# Altium schematic sheet Measurement.SchDoc
size A4; CompanyName: Technische Hochschule Nürnberg Georg Simon Ohm; Organization: UltraZohm; Address1: Kesslerplatz 12; Address2: 90489 Nürnberg; Address3: GERMANY; DocumentNumber: 3; SheetNumber: 3; SheetTotal: 4; Website: www.ultrazohm.com
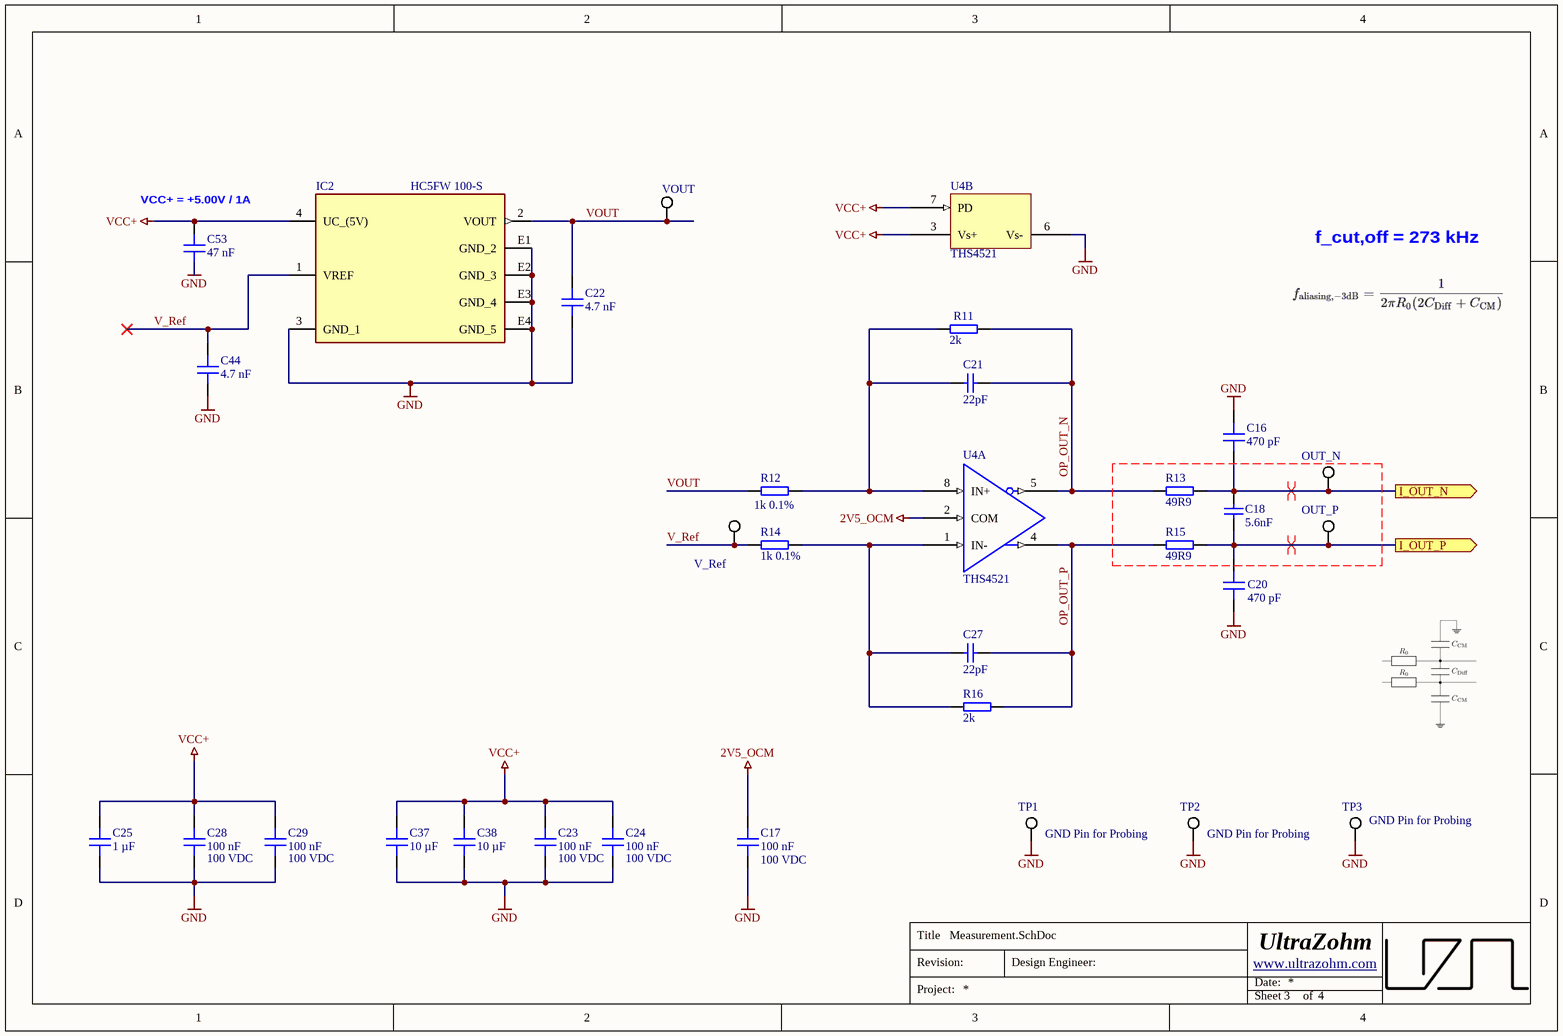
[diagram p0: Measurement.SchDoc]

## Parts
C16  470 pF  [C_0603]
C17  100 nF  Voltage Rating: 100 VDC  [C_0603]
C18  5.6nF  [C_0603_TE]
C20  470 pF  [C_0603]
C21  22pF  [C_0603_TE]
C22  4.7 nF  [C_0603]
C23  100 nF  Voltage Rating: 100 VDC  [C_0603]
C24  100 nF  Voltage Rating: 100 VDC  [C_0603]
C25  1 µF  [C_0603]
C27  22pF  [C_0603_TE]
C28  100 nF  Voltage Rating: 100 VDC  [C_0603]
C29  100 nF  Voltage Rating: 100 VDC  [C_0603]
C37  10 µF  [C0805]
C38  10 µF  [C0805]
C44  4.7 nF  [C_0603]
C53  47 nF  [C_0603]
IC2  HC5FW 100-S  [LEM_HC5FW]
OUT_N  5015  [KSTN-5019_V]  (value not drawn)
OUT_P  5015  [KSTN-5019_V]  (value not drawn)
R11  2k  [RES 0603_1608]
R12  1k 0.1%  [RES 0603_1608]
R13  49R9  [RES 0603_1608]
R14  1k 0.1%  [RES 0603_1608]
R15  49R9  [RES 0603_1608]
R16  2k  [RES 0603_1608]
TP1  5015  [KSTN-5019_V]  (value not drawn)
TP2  5015  [KSTN-5019_V]  (value not drawn)
TP3  5015  [KSTN-5019_V]  (value not drawn)
U4  THS4521  [SOIC127P600X175-8N]  (parts A,B of 2)
V_Ref  5015  [KSTN-5019_V]  (value not drawn)
VOUT  5019  [KSTN-5019_V]  (value not drawn)

## Ports
I_OUT_N (out), I_OUT_P (out)

## Nets
2V5_OCM: C17.1 U4.2(COM)
GND: C16.1 C17.2 C20.2 C22.1 C23.1 C24.1 C25.1 C28.1 C29.1 C37.1 C38.1 C44.1 C53.1 IC2.3(GND_1) IC2.E1(GND_2) IC2.E2(GND_3) IC2.E3(GND_4) IC2.E4(GND_5) TP1.1 TP2.1 TP3.1 U4.6(Vs-)
VCC+: C23.2 C24.2 C25.2 C28.2 C29.2 C37.2 C38.2 C53.2 IC2.4(UC_(5V)) U4.3(Vs+) U4.7(PD)
I_OUT_N: C16.2 C18.1 OUT_N.1 R13.2 ; port I_OUT_N
I_OUT_P: C18.2 C20.1 OUT_P.1 R15.2 ; port I_OUT_P
OP_OUT_N: C21.1 R11.2 R13.1 U4.5(OUT-)
OP_OUT_P: C27.1 R15.1 R16.2 U4.4(OUT+)
V_Ref: C44.2 IC2.1(VREF) R14.1 V_Ref.1
VOUT: C22.2 IC2.2(VOUT) R12.1 VOUT.1
NetC21_2: C21.2 R11.1 R12.2 U4.8(IN+)
NetC27_2: C27.2 R14.2 R16.1 U4.1(IN-)

## Layout directives
differential pair: I_OUT_N, I_OUT_P

## Notes on the sheet
- (near C53) VCC+ = +5.00V / 1A
- f_cut,off = 273 kHz
- (near TP1) GND Pin for Probing
- (near TP2) GND Pin for Probing
- (near TP3) GND Pin for Probing
- Title
- Revision:
- Design Engineer:
- Date:
- Project:
- Sheet
- of

## Library data of the parts
C16 C20 = C0603C471K5RACAUTO: 50V 470pF X7R ±10% 0603 Multilayer Ceramic Capacitors MLCC - SMD/SMT ROHS; Manufacturer: KEMET; Voltage Rating: 50 VDC; Created from: KIlhan; Manufacturer Part Number: C0603C471K5RACAUTO; ComponentLink1Description: Datasheet; ComponentLink1URL: https://lcsc.com/datasheet/lcsc_datasheet_2410010302_KEMET-C0603C471K5RACAUTO_C129628.pdf; Series: SMD Comm X7R; Supplier 1: JLCPCB; Supplier Part Number 1: C129628; Tolerance: 10 %; PartID: 500; Created On: 07/07/2025 10:21:07; Component Type: Capacitor 0603; Device Package: 0603; Last Updated: 07/07/2025 10:21:07; Mounting Type: SMD; Operating Temperature: -55 - 125°C; Type: Capacitor; Value: 470 pF; Live Cycle Status: 1; Stock number: not stored; LCSC Part Number: C129628
C17 C23 C24 C28 C29 = C1608X7S2A104KT000N: 100V 100nF X7S ±10% 0603 Multilayer Ceramic Capacitors MLCC - SMD/SMT ROHS; Manufacturer: TDK; Created from: AGeiger; Manufacturer Part Number: C1608X7S2A104KT000N; PartID: 148; Created On: 20.12.2020 13:54:13; ComponentLink1Description: Datasheet; ComponentLink1URL: https://datasheet.lcsc.com/lcsc/2304140030_TDK-C1608X7S2A104KT000N_C343025.pdf; Component Type: Capacitor 0603; Device Package: 0603; Last Updated: 14.12.2022 12:14:21; Mounting Type: SMD; Operating Temperature: -55 to 125°C; Series: X7R; Supplier 1: LCSC; Supplier Part Number 1: C343025; Type: Capacitor; Tolerance: 10 %; Value: 100 nF; Live Cycle Status: 1; LCSC Part Number: C343025; Stock number: not stored
C18 = 0603B562K500NT: 50V 5.6nF X7R ±10% 0603 Multilayer Ceramic Capacitors MLCC - SMD/SMT ROHS; Manufacturer: FH (Guangdong Fenghua Advanced Tech); Created from: Kilhan; Manufacturer Part Number: 0603B562K500NT; ComponentLink1Description: Datasheet; ComponentLink1URL: https://jlcpcb.com/api/file/downloadByFileSystemAccessId/8588903217349971968; Series: X7R; Supplier 1: LCSC; Supplier Part Number 1: C1628; Tolerance: 10%; Voltage Rating: 50V; PartID: 171; Created On: 18/06/2025 16:23:16; Component Type: Capacitor 0603; Device Package: 0603; Last Updated: 18/06/2025 16:23:16; Mounting Type: SMD; Operating Temperature: –55 to 125°C; Type: Capacitor; Value: 5.6nF; Live Cycle Status: 1; Stock number: not stored; LCSC Part Number: C1628
C21 C27 = CL10C220JB8NNNC: 50V 22pF C0G ±5% 0603 Multilayer Ceramic Capacitors MLCC - SMD/SMT ROHS; Manufacturer: Samsung Electro-Mechanics; Created from: Kilhan; Manufacturer Part Number: CL10C220JB8NNNC; ComponentLink1Description: Datasheet; ComponentLink1URL: https://jlcpcb.com/api/file/downloadByFileSystemAccessId/8579707043277824000; Series: C0G; Supplier 1: LCSC; Supplier Part Number 1: C1653; Tolerance: 5%; Voltage Rating: 50V; PartID: 172; Created On: 22/06/2025 13:02:55; Component Type: Capacitor 0603; Device Package: 0603; Last Updated: 22/06/2025 13:02:55; Mounting Type: SMD; Operating Temperature: –55 to 125°C; Type: Capacitor; Value: 22pF; Live Cycle Status: 1; Stock number: not stored; LCSC Part Number: C1653
C22 C44 = C0603C472K4RECAUTO: Capacitor 0603, 16 VDC, 4.7 nF, X7R; Manufacturer: KEMET; Tolerance: 10 %; Voltage Rating: 16 VDC; Created from: MGremer; Manufacturer Part Number: C0603C472K4RECAUTO; PartID: 35; Created On: 20/12/2020 13:54:13; ComponentLink1Description: Datasheet; ComponentLink1URL: https://www.mouser.de/datasheet/2/212/1/KEM_C1090_X7R_ESD-1103328.pdf; Component Type: Capacitor 0603; Device Package: 0603; Last Updated: 05/08/2026 12:55:18; Mounting Type: SMD; Operating Temperature: -55 - 125°C; Series: ESD SMD Auto X7R; Supplier 1: Mouser; Supplier Part Number 1: 80-C0603C472K4RECAUT; Type: Capacitor; Value: 4.7 nF; Live Cycle Status: 1; LCSC Part Number: C2176713; Stock number: Labor SMD Container
C25 = CL10A105KB8NNNC: 50V 1uF X5R ±10% 0603  Multilayer Ceramic Capacitors MLCC - SMD/SMT ROHS; Manufacturer: Samsung Electro-Mechanics; Voltage Rating: 50 VDC; Created from: MGremer; Manufacturer Part Number: CL10A105KB8NNNC; PartID: 5; Created On: 20/12/2020 13:54:13; ComponentLink1Description: Datasheet; ComponentLink1URL: https://datasheet.lcsc.com/lcsc/1810261812_Samsung-Electro-Mechanics-CL10A105KB8NNNC_C15849.pdf; Component Type: Capacitor 0603; Device Package: 0603; Last Updated: 28/11/2022 17:23:01; Mounting Type: SMD; Operating Temperature: -55 - 85°C; Series: M; Supplier 1: LCSC; Supplier Part Number 1: C15849; Type: Capacitor; Tolerance: 10 %; Value: 1 µF; Live Cycle Status: 1; Stock number: Labor SMD Container; LCSC Part Number: C15849
C37 C38 = GRM21BR6YA106KE43L: Capacitor 0805, 35 VDC, 10 µF, X5R; Manufacturer: muRata; Tolerance: 10 %; Voltage Rating: 35 VDC; Created from: MGremer; Manufacturer Part Number: GRM21BR6YA106KE43L; PartID: 28; Created On: 20.12.2020 13:54:13; ComponentLink1Description: Datasheet; ComponentLink1URL: https://www.mouser.de/datasheet/2/281/murata_03052018_GRM_Series_1-1310166.pdf; Component Type: Capacitor 0805; Device Package: 0805; Last Updated: 20.12.2020 17:44:37; Mounting Type: SMD; Operating Temperature: -55 - 85°C; Series: GRM; Supplier 1: Mouser; Supplier Part Number 1: 81-GRM21BR6YA106KE3L; Type: Capacitor; Value: 10 µF; Live Cycle Status: 1; Stock number: Labor SMD Container; LCSC Part Number: C162422
C53 = CL10B473KB8NNNC: Capacitor 0603, 50 VDC, 47 nF, X7R; Manufacturer: Samsung Electro-Mechanics; Tolerance: 10 %; Voltage Rating: 50 VDC; Created from: DHufnagel; Manufacturer Part Number: CL10B473KB8NNNC; PartID: 97; Created On: 20/07/2022 09:55:05; ComponentLink1Description: Datasheet; ComponentLink1URL: https://www.mouser.de/datasheet/2/585/MLCC-1837944.pdf; Component Type: Capacitor 0603; Device Package: 0603; Last Updated: 20/07/2022 09:55:05; Mounting Type: SMD; Operating Temperature: -55 - 125°C; Series: X7R; Supplier 1: Mouser; Supplier Part Number 1: 187-CL10B473KB8NNNC; Supplier 2: LCSC; Supplier Part Number 2: C1622; Type: Capacitor; Value: 47 nF; Live Cycle Status: 1; LCSC Part Number: C1622; Stock number: not stored
IC2 = HC5FW 100-S: -100 A - 100 A, 40 kHz; Manufacturer: LEM; Value: 100A; Created from: TGaupp; Datasheet Link: https://www.lem.com/sites/default/files/products_datasheets/cksr_series.pdf; Height: 16mm; Manufacturer Part Number: HC5FW 100-S; Supplier Part Number 1: 61-HC5FW100-S; Mounting Technology: THT; Supplier 1: Mouser; PartID: 7; Created On: 01/07/2026 10:26:16; ComponentLink1Description: Datasheet; ComponentLink1URL: https://www.lem.com/sites/default/files/products_datasheets/hc5fw_100-s.pdf; Component Type: Hall-Current Sensor; Device Package: THT; Last Updated: 01/07/2026 10:26:16; Mounting Type: THT; Operating Temperature: -40 - 125°C; Series: HC5 Series; Type: Current Sensor; Live Cycle Status: 1; Stock number: not stocked
OUT_N OUT_P TP1-TP3 V_Ref = 5015: Circuit Board Hardware - PCB SM TEST POINT ON T&R - MINIATURE; Manufacturer: Keystone Electronics; Value: SMD Testpoint; Created from: AGeiger; Supplier Part Number 1: 534-5015; LCSC Part Number: C5199798; Manufacturer Part Number: 5015; PartID: 26; Created On: 03/06/2023 11:19:55; ComponentLink1Description: Datasheet; ComponentLink1URL: https://www.mouser.de/datasheet/2/215/015-744075.pdf; Component Type: Circuit Board Hardware; Device Package: SMD; Last Updated: 03/06/2023 11:43:17; Mounting Type: SMD; Supplier 1: Mouser; Type: PCB SMD Testpoint; Live Cycle Status: 1; ComponentLink2URL: http://www.keyelco.com/product-pdf.cfm?p=1357; ComponentLink2Description: Datasheet
R11 R16 = ERJ-PB3B2001V: SMD resistor 0.1%; Manufacturer: Panasonic; Created from: DHufnagel; Manufacturer Part Number: ERJ-PB3B2001V; PartID: 215; Created On: 14/12/2020 16:17:14; ComponentLink1Description: Datasheet; ComponentLink1URL: https://www.mouser.de/datasheet/2/315/AOA0000C328-1530132.pdf; Component Type: SMD resistor; Device Package: 0603; Last Updated: 02/03/2021 14:07:32; Mounting Type: SMD; Supplier 1: Mouser; Supplier Part Number 1: 667-ERJ-PB3B2001V; Type: Resistor; Value: 2k; Live Cycle Status: 1; Stock number: not stored; LCSC Part Number: C189729; Tolerance: 0.1%; Supplier 2: LCSC; Supplier Part Number 2: C189729
R12 R14 = AR03BTCX1001: 100mW ±0.1% ±25ppm/℃ 1kΩ 0603 Chip Resistor - Surface Mount ROHS; Manufacturer: Viking Tech; Created from: AGeiger; Manufacturer Part Number: AR03BTCX1001; PartID: 240; Created On: 03/09/2022 10:12:43; ComponentLink1Description: Datasheet; ComponentLink1URL: https://datasheet.lcsc.com/lcsc/2011191435_Viking-Tech-AR03BTCX1001_C304069.pdf; Component Type: SMD resistor; Device Package: 0603; Last Updated: 03/09/2022 10:12:43; Mounting Type: SMD; Supplier 1: LCSC; Supplier Part Number 1: C304069; Type: Resistor; Value: 1k; Live Cycle Status: 1; LCSC Part Number: C304069; Tolerance: 0.1%
R13 R15 = RC0603FR-0749R9L: 100mW Thick Film Resistors ±100ppm/℃ ±1% 49.9Ω 0603 Chip Resistor - Surface Mount ROHS; Manufacturer: YAGEO; Created from: AGeiger; Manufacturer Part Number: RC0603FR-0749R9L; PartID: 277; Created On: 14/06/2023 17:42:26; ComponentLink1Description: Datasheet; ComponentLink1URL: https://datasheet.lcsc.com/lcsc/2304140030_YAGEO-RC0603FR-0749R9L_C114625.pdf; Component Type: SMD resistor; Device Package: 0603; Last Updated: 14/06/2023 17:42:26; Mounting Type: SMD; Supplier 1: LCSC; Supplier Part Number 1: C114625; Type: Resistor; Tolerance: 1%; Value: 49R9; Live Cycle Status: 1; LCSC Part Number: C114625
U4 = THS4521IDR: THS452x Very Low Power, Negative Rail Input, Rail-To-Rail Output, Fully Differential Amplifier; Manufacturer: Texas Instruments; Channels: 1; GBP: 145 MHz; Created from: AGeiger; Manufacturer Part Number: THS4521IDR; PartID: 15; Created On: 03/09/2022 09:19:34; ComponentLink1Description: Datasheet; ComponentLink1URL: https://www.ti.com/cn/lit/ds/symlink/ths4521.pdf?ts=1662191143470; Component Type: Differential Amplifier; Device Package: SOIC-8; Last Updated: 30/09/2024 15:54:43; Mounting Type: SMD; Operating Temperature: -40 to +85 °C; Series: THS4521; Supplier 1: LCSC; Supplier Part Number 1: C16092; Type: Differential Amplifiers; Value: THS4521; Live Cycle Status: 1; LCSC Part Number: C16092
VOUT = 5019: Circuit Board Hardware - PCB SM TEST POINT ON T&R - MINIATURE; Manufacturer: Keystone Electronics; Value: SMD Testpoint; Created from: AGeiger; ComponentLink1Description: Datasheet; ComponentLink2URL: http://www.keyelco.com/product-pdf.cfm?p=1357; ComponentLink1URL: https://www.mouser.de/datasheet/2/215/019-743690.pdf; ComponentLink2Description: Datasheet; Manufacturer Part Number: 5019; PartID: 27; Created On: 03/06/2023 11:34:10; Component Type: Circuit Board Hardware; Device Package: SMD; Last Updated: 03/06/2023 11:43:17; Mounting Type: SMD; Supplier 1: Mouser; Supplier Part Number 1: 534-5019; Type: PCB SMD Testpoint; Live Cycle Status: 1; LCSC Part Number: C5199800